# Altium schematic sheet uC.SchDoc
size A3
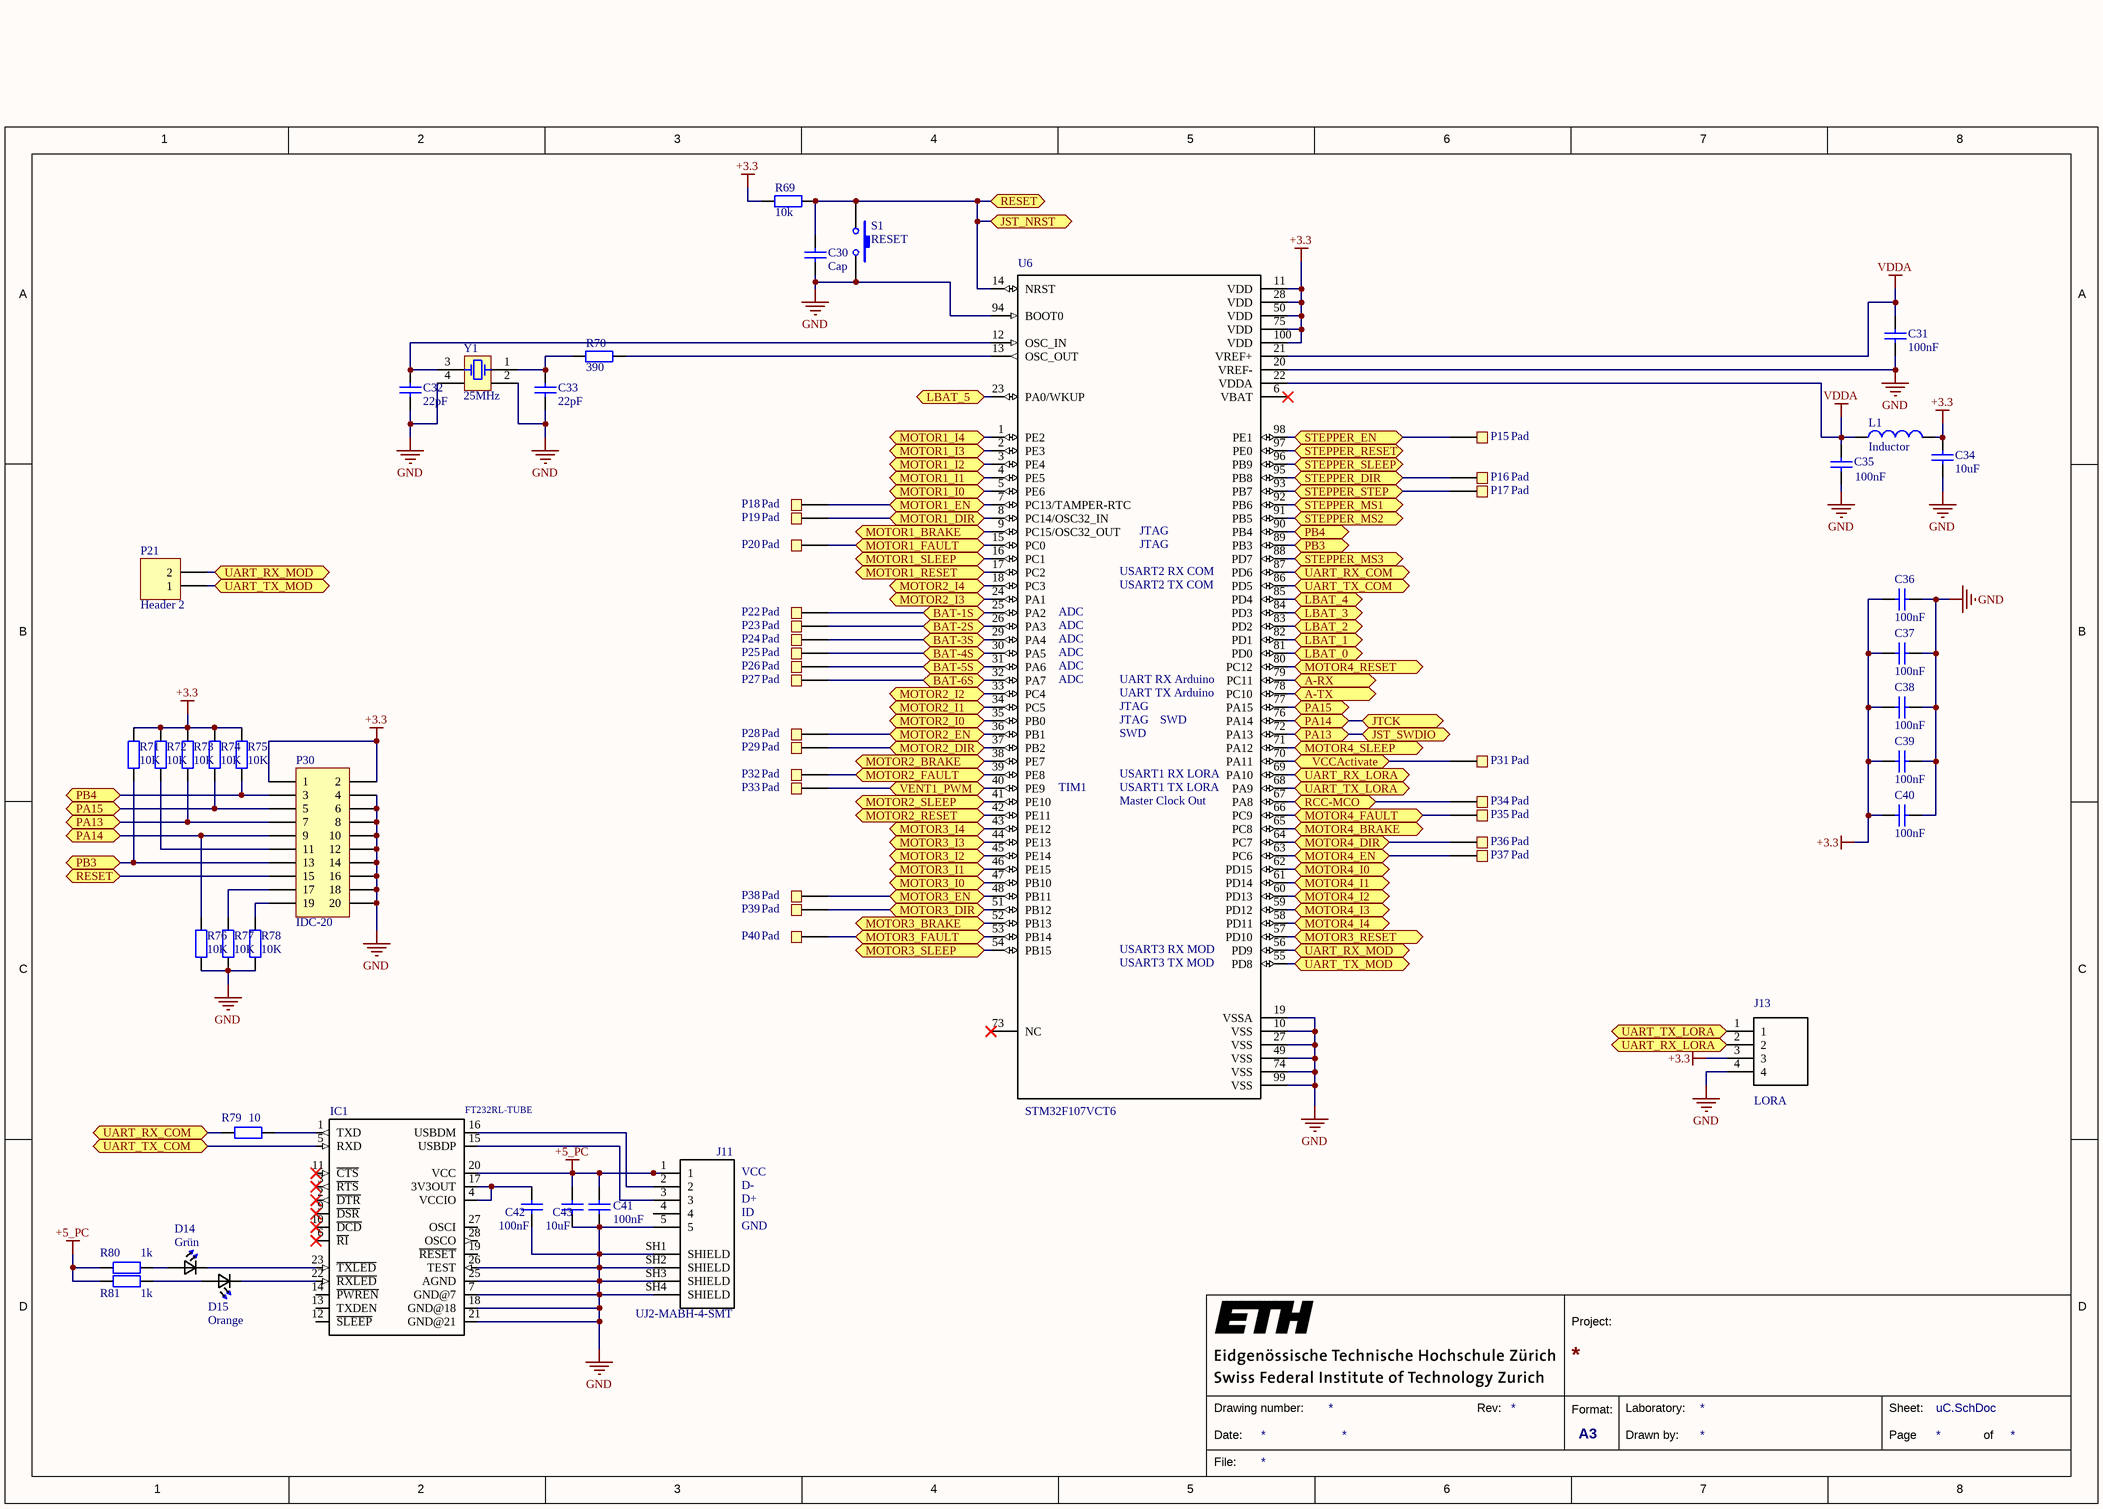
[diagram p0: uC.SchDoc]

## Parts
C30  Cap  [CAP_0603i_1608m -N]
C31  100nF  [CAP_0603i_1608m -N]
C32  22pF  [CAP_0603i_1608m -N]
C33  22pF  [CAP_0603i_1608m -N]
C34  10uF  [CAP_0805i_2012m -N]
C35  100nF  [CAP_0603i_1608m -N]
C36  100nF  [CAP_0603i_1608m -N]
C37  100nF  [CAP_0603i_1608m -N]
C38  100nF  [CAP_0603i_1608m -N]
C39  100nF  [CAP_0603i_1608m -N]
C40  100nF  [CAP_0603i_1608m -N]
C41  100nF  [CAP_0603i_1608m -L]
C42  100nF  [CAP_0603i_1608m -L]
C43  10uF  [CAP_0805i_2012m -L]
D14  Grün  [*0603]
D15  Orange  [*0603]
IC1  FT232RL-TUBE  [*SSOP28-LD]  (value not drawn)
J11  UJ2-MABH-4-SMT  [*CUI_UJ2-MABH-4-SMT_UJ2-MABH-4-SMT(Primary)]
J13  LORA  [*PHOENIX_1751264]
L1  Inductor  [IND_0603i_1608m -L]
P15  Pad  [PIN1]
P16  Pad  [PIN1]
P17  Pad  [PIN1]
P18  Pad  [PIN1]
P19  Pad  [PIN1]
P20  Pad  [PIN1]
P21  Header 2  [3.5MM Phoenix Contact 1984617]
P22  Pad  [PIN1]
P23  Pad  [PIN1]
P24  Pad  [PIN1]
P25  Pad  [PIN1]
P26  Pad  [PIN1]
P27  Pad  [PIN1]
P28  Pad  [PIN1]
P29  Pad  [PIN1]
P30  IDC-20  [IDC-20]
P31  Pad  [PIN1]
P32  Pad  [PIN1]
P33  Pad  [PIN1]
P34  Pad  [PIN1]
P35  Pad  [PIN1]
P36  Pad  [PIN1]
P37  Pad  [PIN1]
P38  Pad  [PIN1]
P39  Pad  [PIN1]
P40  Pad  [PIN1]
R69  10k  [RES_0805i_2012m -N]
R70  390  [RES_0805i_2012m -N]
R71  10K  [RES_0603i_1608m -N]
R72  10K  [RES_0603i_1608m -N]
R73  10K  [RES_0603i_1608m -N]
R74  10K  [RES_0603i_1608m -N]
R75  10K  [RES_0603i_1608m -N]
R76  10K  [RES_0603i_1608m -N]
R77  10K  [RES_0603i_1608m -N]
R78  10K  [RES_0603i_1608m -N]
R79  10  [RES_0603i_1608m -N]
R80  1k  [RES_0603i_1608m -N]
R81  1k  [RES_0603i_1608m -N]
S1  RESET  [B3SL-1002P]
U6  STM32F107VCT6  [*QFP50P1600X1600X160-100N]
Y1  25MHz  [TSX-3225 2*2.5]

## Ports
A-RX (bidir), A-TX (bidir), BAT-1S (bidir), BAT-2S (bidir), BAT-3S (bidir), BAT-4S (bidir), BAT-5S (bidir), BAT-6S (bidir), JST_NRST (bidir), JST_SWDIO (bidir), JTCK (bidir), LBAT_0 (bidir), LBAT_1 (bidir), LBAT_2 (bidir), LBAT_3 (bidir), LBAT_4 (bidir), LBAT_5 (bidir), MOTOR1_BRAKE (bidir), MOTOR1_DIR (bidir), MOTOR1_EN (bidir), MOTOR1_FAULT (bidir), MOTOR1_I0 (bidir), MOTOR1_I1 (bidir), MOTOR1_I2 (bidir), MOTOR1_I3 (bidir), MOTOR1_I4 (bidir), MOTOR1_RESET (bidir), MOTOR1_SLEEP (bidir), MOTOR2_BRAKE (bidir), MOTOR2_DIR (bidir), MOTOR2_EN (bidir), MOTOR2_FAULT (bidir), MOTOR2_I0 (bidir), MOTOR2_I1 (bidir), MOTOR2_I2 (bidir), MOTOR2_I3 (bidir), MOTOR2_I4 (bidir), MOTOR2_RESET (bidir), MOTOR2_SLEEP (bidir), MOTOR3_BRAKE (bidir), MOTOR3_DIR (bidir), MOTOR3_EN (bidir), MOTOR3_FAULT (bidir), MOTOR3_I0 (bidir), MOTOR3_I1 (bidir), MOTOR3_I2 (bidir), MOTOR3_I3 (bidir), MOTOR3_I4 (bidir), MOTOR3_RESET (bidir), MOTOR3_SLEEP (bidir), MOTOR4_BRAKE (bidir), MOTOR4_DIR (bidir), MOTOR4_EN (bidir), MOTOR4_FAULT (bidir), MOTOR4_I0 (bidir), MOTOR4_I1 (bidir), MOTOR4_I2 (bidir), MOTOR4_I3 (bidir), MOTOR4_I4 (bidir), MOTOR4_RESET (bidir), MOTOR4_SLEEP (bidir), PA13 (bidir), PA14 (bidir), PA15 (bidir), PB3 (bidir), PB4 (bidir), RCC-MCO (bidir), RESET (bidir), STEPPER_DIR (bidir), STEPPER_EN (bidir), STEPPER_MS1 (bidir), STEPPER_MS2 (bidir), STEPPER_MS3 (bidir), STEPPER_RESET (bidir), STEPPER_SLEEP (bidir), STEPPER_STEP (bidir), UART_RX_COM (bidir), UART_RX_LORA (bidir), UART_RX_MOD (bidir), UART_TX_COM (bidir), UART_TX_LORA (bidir), UART_TX_MOD (bidir), VCCActivate (bidir), VENT1_PWM (bidir)

## Nets
+3.3: C34.2 C36.2 C37.2 C38.2 C39.2 C40.2 J13.3 L1.2 P30.1 P30.2 R69.1 R71.2 R72.2 R73.2 R74.2 R75.2 U6.11(VDD) U6.28(VDD) U6.50(VDD) U6.75(VDD) U6.100(VDD)
+5_PC: C41.2 C43.2 IC1.20(VCC) J11.1 R80.2 R81.2
GND: C30.1 C31.1 C32.1 C33.1 C34.1 C35.1 C36.1 C37.1 C38.1 C39.1 C40.1 C41.1 C42.1 C43.1 IC1.7(GND@7) IC1.18(GND@18) IC1.21(GND@21) IC1.25(AGND) IC1.26(TEST) J11.5 J11.SH1(SHIELD) J11.SH2(SHIELD) J11.SH3(SHIELD) J11.SH4(SHIELD) J13.4 P30.4 P30.6 P30.8 P30.10 P30.12 P30.14 P30.16 P30.18 P30.20 R76.1 R77.1 R78.1 S1.2 U6.10(VSS) U6.19(VSSA) U6.20(VREF-) U6.27(VSS) U6.49(VSS) U6.74(VSS) U6.94(BOOT0) U6.99(VSS) Y1.2(COM) Y1.4(COM)
VDDA: C31.2 C35.2 L1.1 U6.21(VREF+) U6.22(VDDA)
A-RX: U6.79(PC11) ; port A-RX
A-TX: U6.78(PC10) ; port A-TX
BAT-1S: P22.1 U6.25(PA2) ; port BAT-1S
BAT-2S: P23.1 U6.26(PA3) ; port BAT-2S
BAT-3S: P24.1 U6.29(PA4) ; port BAT-3S
BAT-4S: P25.1 U6.30(PA5) ; port BAT-4S
BAT-5S: P26.1 U6.31(PA6) ; port BAT-5S
BAT-6S: P27.1 U6.32(PA7) ; port BAT-6S
JST_NRST: C30.2 P30.15 R69.2 S1.1 U6.14(NRST) ; port RESET, port JST_NRST
JST_SWDIO: P30.7 R73.1 U6.72(PA13) ; port PA13, port JST_SWDIO
JTCK: P30.9 R76.2 U6.76(PA14) ; port PA14, port JTCK
LBAT_0: U6.81(PD0) ; port LBAT_0
LBAT_1: U6.82(PD1) ; port LBAT_1
LBAT_2: U6.83(PD2) ; port LBAT_2
LBAT_3: U6.84(PD3) ; port LBAT_3
LBAT_4: U6.85(PD4) ; port LBAT_4
LBAT_5: U6.23(PA0/WKUP) ; port LBAT_5
MOTOR1_BRAKE: U6.9(PC15/OSC32_OUT) ; port MOTOR1_BRAKE
MOTOR1_DIR: P19.1 U6.8(PC14/OSC32_IN) ; port MOTOR1_DIR
MOTOR1_EN: P18.1 U6.7(PC13/TAMPER-RTC) ; port MOTOR1_EN
MOTOR1_FAULT: P20.1 U6.15(PC0) ; port MOTOR1_FAULT
MOTOR1_I0: U6.5(PE6) ; port MOTOR1_I0
MOTOR1_I1: U6.4(PE5) ; port MOTOR1_I1
MOTOR1_I2: U6.3(PE4) ; port MOTOR1_I2
MOTOR1_I3: U6.2(PE3) ; port MOTOR1_I3
MOTOR1_I4: U6.1(PE2) ; port MOTOR1_I4
MOTOR1_RESET: U6.17(PC2) ; port MOTOR1_RESET
MOTOR1_SLEEP: U6.16(PC1) ; port MOTOR1_SLEEP
MOTOR2_BRAKE: U6.38(PE7) ; port MOTOR2_BRAKE
MOTOR2_DIR: P29.1 U6.37(PB2) ; port MOTOR2_DIR
MOTOR2_EN: P28.1 U6.36(PB1) ; port MOTOR2_EN
MOTOR2_FAULT: P32.1 U6.39(PE8) ; port MOTOR2_FAULT
MOTOR2_I0: U6.35(PB0) ; port MOTOR2_I0
MOTOR2_I1: U6.34(PC5) ; port MOTOR2_I1
MOTOR2_I2: U6.33(PC4) ; port MOTOR2_I2
MOTOR2_I3: U6.24(PA1) ; port MOTOR2_I3
MOTOR2_I4: U6.18(PC3) ; port MOTOR2_I4
MOTOR2_RESET: U6.42(PE11) ; port MOTOR2_RESET
MOTOR2_SLEEP: U6.41(PE10) ; port MOTOR2_SLEEP
MOTOR3_BRAKE: U6.52(PB13) ; port MOTOR3_BRAKE
MOTOR3_DIR: P39.1 U6.51(PB12) ; port MOTOR3_DIR
MOTOR3_EN: P38.1 U6.48(PB11) ; port MOTOR3_EN
MOTOR3_FAULT: P40.1 U6.53(PB14) ; port MOTOR3_FAULT
MOTOR3_I0: U6.47(PB10) ; port MOTOR3_I0
MOTOR3_I1: U6.46(PE15) ; port MOTOR3_I1
MOTOR3_I2: U6.45(PE14) ; port MOTOR3_I2
MOTOR3_I3: U6.44(PE13) ; port MOTOR3_I3
MOTOR3_I4: U6.43(PE12) ; port MOTOR3_I4
MOTOR3_RESET: U6.57(PD10) ; port MOTOR3_RESET
MOTOR3_SLEEP: U6.54(PB15) ; port MOTOR3_SLEEP
MOTOR4_BRAKE: U6.65(PC8) ; port MOTOR4_BRAKE
MOTOR4_DIR: P36.1 U6.64(PC7) ; port MOTOR4_DIR
MOTOR4_EN: P37.1 U6.63(PC6) ; port MOTOR4_EN
MOTOR4_FAULT: P35.1 U6.66(PC9) ; port MOTOR4_FAULT
MOTOR4_I0: U6.62(PD15) ; port MOTOR4_I0
MOTOR4_I1: U6.61(PD14) ; port MOTOR4_I1
MOTOR4_I2: U6.60(PD13) ; port MOTOR4_I2
MOTOR4_I3: U6.59(PD12) ; port MOTOR4_I3
MOTOR4_I4: U6.58(PD11) ; port MOTOR4_I4
MOTOR4_RESET: U6.80(PC12) ; port MOTOR4_RESET
MOTOR4_SLEEP: U6.71(PA12) ; port MOTOR4_SLEEP
PA15: P30.5 R74.1 U6.77(PA15) ; port PA15
PB3: P30.13 R71.1 U6.89(PB3) ; port PB3
PB4: P30.3 R75.1 U6.90(PB4) ; port PB4
RCC-MCO: P34.1 U6.67(PA8) ; port RCC-MCO
STEPPER_DIR: P16.1 U6.95(PB8) ; port STEPPER_DIR
STEPPER_EN: P15.1 U6.98(PE1) ; port STEPPER_EN
STEPPER_MS1: U6.92(PB6) ; port STEPPER_MS1
STEPPER_MS2: U6.91(PB5) ; port STEPPER_MS2
STEPPER_MS3: U6.88(PD7) ; port STEPPER_MS3
STEPPER_RESET: U6.97(PE0) ; port STEPPER_RESET
STEPPER_SLEEP: U6.96(PB9) ; port STEPPER_SLEEP
STEPPER_STEP: P17.1 U6.93(PB7) ; port STEPPER_STEP
UART_RX_COM: R79.2 U6.87(PD6) ; port UART_RX_COM
UART_RX_LORA: J13.2 U6.69(PA10) ; port UART_RX_LORA
UART_RX_MOD: P21.2 U6.56(PD9) ; port UART_RX_MOD
UART_TX_COM: IC1.5(RXD) U6.86(PD5) ; port UART_TX_COM
UART_TX_LORA: J13.1 U6.68(PA9) ; port UART_TX_LORA
UART_TX_MOD: P21.1 U6.55(PD8) ; port UART_TX_MOD
VCCActivate: P31.1 U6.70(PA11) ; port VCCActivate
VENT1_PWM: P33.1 U6.40(PE9) ; port VENT1_PWM
NetC32_2: C32.2 U6.12(OSC_IN) Y1.3(OSC2)
NetC33_2: C33.2 R70.2 Y1.1(OSC1)
NetC42_2: C42.2 IC1.4(VCCIO) IC1.17(3V3OUT)
NetD14_1: D14.1(K2) IC1.23(~{TXLED})
NetD14_2: D14.2(A2) R80.1
NetD15_1: D15.1(K2) IC1.22(~{RXLED})
NetD15_2: D15.2(A2) R81.1
NetIC1_1: IC1.1(TXD) R79.1
NetIC1_15: IC1.15(USBDP) J11.3
NetIC1_16: IC1.16(USBDM) J11.2
NetP30_11: P30.11 R72.1
NetP30_17: P30.17 R77.2
NetP30_19: P30.19 R78.2
NetR70_1: R70.1 U6.13(OSC_OUT)

Not connected (* = marked no-connect by the designer): IC1 2(~{DTR})* 3(~{RTS})* 6(~{RI})* 9(~{DSR})* 10(~{DCD})* 11(~{CTS})* 12(~{SLEEP}) 13(TXDEN) 14(~{PWREN}) 19(~{RESET}) 27(OSCI) 28(OSCO); J11 4; U6 6(VBAT)* 73(NC)*

## Notes on the sheet
- (near U6) USART2 RX COM
- (near U6) USART2 TX COM
- (near U6) JTAG
- (near U6) ADC
- (near U6) UART RX Arduino
- (near U6) UART TX Arduino
- (near U6) SWD
- (near U6) USART1 RX LORA
- (near U6) TIM1
- (near U6) USART1 TX LORA
- (near U6) Master Clock Out
- (near U6) USART3 RX MOD
- (near U6) USART3 TX MOD
- VCC
- D-
- D+
- ID
- GND
- 1
- 2
- 3
- 4
- 5
- 6
- 7
- 8
- A
- B
- C
- D
- Project:
- Date:
- Drawing number:
- Rev:
- Format:
- A3
- Drawn by:
- Laboratory:
- Page
- Sheet:
- of
- File:

## Library data of the parts
C30-C43 = Cap: capacitor
D14 = LTST-C191KGKT: / LED; SMD; 0603; grün; 35mcd; 1.6x0.8x0.55mm; 130Â°; 2Ã·2.V; 20mA /; MF: Lite-On Inc.; Digi-Key_Purchase_URL: https://www.digikey.ch/product-detail/de/lite-on-inc/LTST-C191KGKT/160-1446-1-ND/386834; SnapEDA_Link: https://www.snapeda.com/parts/LTST-C191KFKT/Lite-On%20Inc./view-part/?ref=snap; MP: LTST-C191KGKT; Digi-Key_Part_Number: 160-1446-1-ND; Package: 0603 Lite-On; Value: *
D15 = LTST-C191KFKT: / LED; SMD; 0603; orange; 45-90mcd; 1.6x0.8x0.55mm; 130Â°; 2Ã·2.4V; 20mA /; MF: Lite-On Inc.; Digi-Key_Purchase_URL: https://www.digikey.com/product-detail/en/lite-on-inc/LTST-C191KFKT/160-1445-1-ND/386832?utm_source=snapeda&utm_medium=aggregator&utm_campaign=symbol; SnapEDA_Link: https://www.snapeda.com/parts/LTST-C191KFKT/Lite-On%20Inc./view-part/?ref=snap; MP: LTST-C191KFKT; Digi-Key_Part_Number: 160-1445-1-ND; Package: 0603 Lite-On; Value: *
IC1 = FT232RL-TUBE: USB-to-UART 1-CH 256byte FIFO 5V 28-Pin SSOP Tube; MF: FTDI,; Digi-Key_Part_Number: 768-1306-ND; Package: SSOP-28 FTDI; Digi-Key_Purchase_URL: https://www.digikey.com/product-detail/en/ftdi-future-technology-devices-international-ltd/FT232RL-TUBE/768-1306-ND/4006920?utm_source=snapeda&utm_medium=aggregator&utm_campaign=symbol; SnapEDA_Link: https://www.snapeda.com/parts/FT232RL-TUBE/FTDI%2C%20Future%20Technology%20Devices%20International%20Ltd/view-part/?ref=snap; MP: FT232RL-TUBE; Value: *
J11 = UJ2-MABH-4-SMT: Mini AB, USB 2.0, 1 A, Right Angle, Surface Mount _SMT_, USB Receptacle; MF: CUI Inc.; Digi-Key_Part_Number: 102-5890-1-ND; Package: None; Digi-Key_Purchase_URL: https://www.digikey.com/product-detail/en/cui-inc/UJ2-MABH-4-SMT-TR/102-5890-1-ND/9838992?utm_source=snapeda&utm_medium=aggregator&utm_campaign=symbol; CUI_purchase_URL: https://www.cui.com/product/interconnect/connectors/usb-connectors/uj2-mabh-smt-series?utm_source=snapeda.com&utm_medium=referral&utm_campaign=snapedaBOM; SnapEDA_Link: https://www.snapeda.com/parts/UJ2-MABH-4-SMT/CUI%20Inc./view-part/?ref=snap; MP: UJ2-MABH-4-SMT; Value: *
J13 = Terminal 4 Pin: Conn; Term Blk; Screw; 4: 3.5 mm; 26-16 AWG; 10 A; 160 V; Solder; 2.5 kV; PA; MP: 1751264; MF: Phoenix Contact; Digi-Key_Purchase_URL: https://www.digikey.com/product-detail/en/phoenix-contact/1751264/277-5744-ND/2511021?utm_source=snapeda&utm_medium=aggregator&utm_campaign=symbol; Package: None; SnapEDA_Link: https://www.snapeda.com/parts/1751264/Phoenix%20Contact/view-part/1231309/?ref=snap; Digi-Key_Part_Number: 277-5744-ND; Value: *
P15-P20 P22-P29 P31-P40 = Pad: Single Pad or Testpoint
P21 = Header 2: Header, 2-Pin
P30 = IDC-20: Connector; IDC, Male Header, Thru-Hole; 20 Position; Vertical; Pitch 2.54 mm; B
R69-R81 = Res: Resistor
S1 = SW PB: Switch
U6 = STM32F107VCT6_1: STM32 Series 32-bit 256 kB Flash 64 kB RAM ARM Based Microcontroller -LQFP-100; MF: STMicroelectronics; Price: None; Package: LQFP-100 STMicroelectronics; SnapEDA_Link: https://www.snapeda.com/parts/STM32F107VCT6/STMicroelectronics/view-part/?ref=snap; MP: STM32F107VCT6; Availability: Unavailable; Value: *
Y1 = XTAL3: Industrial Ceramic Resonator